# EAGLE design 09_JMP (EAGLE 7.5.0)
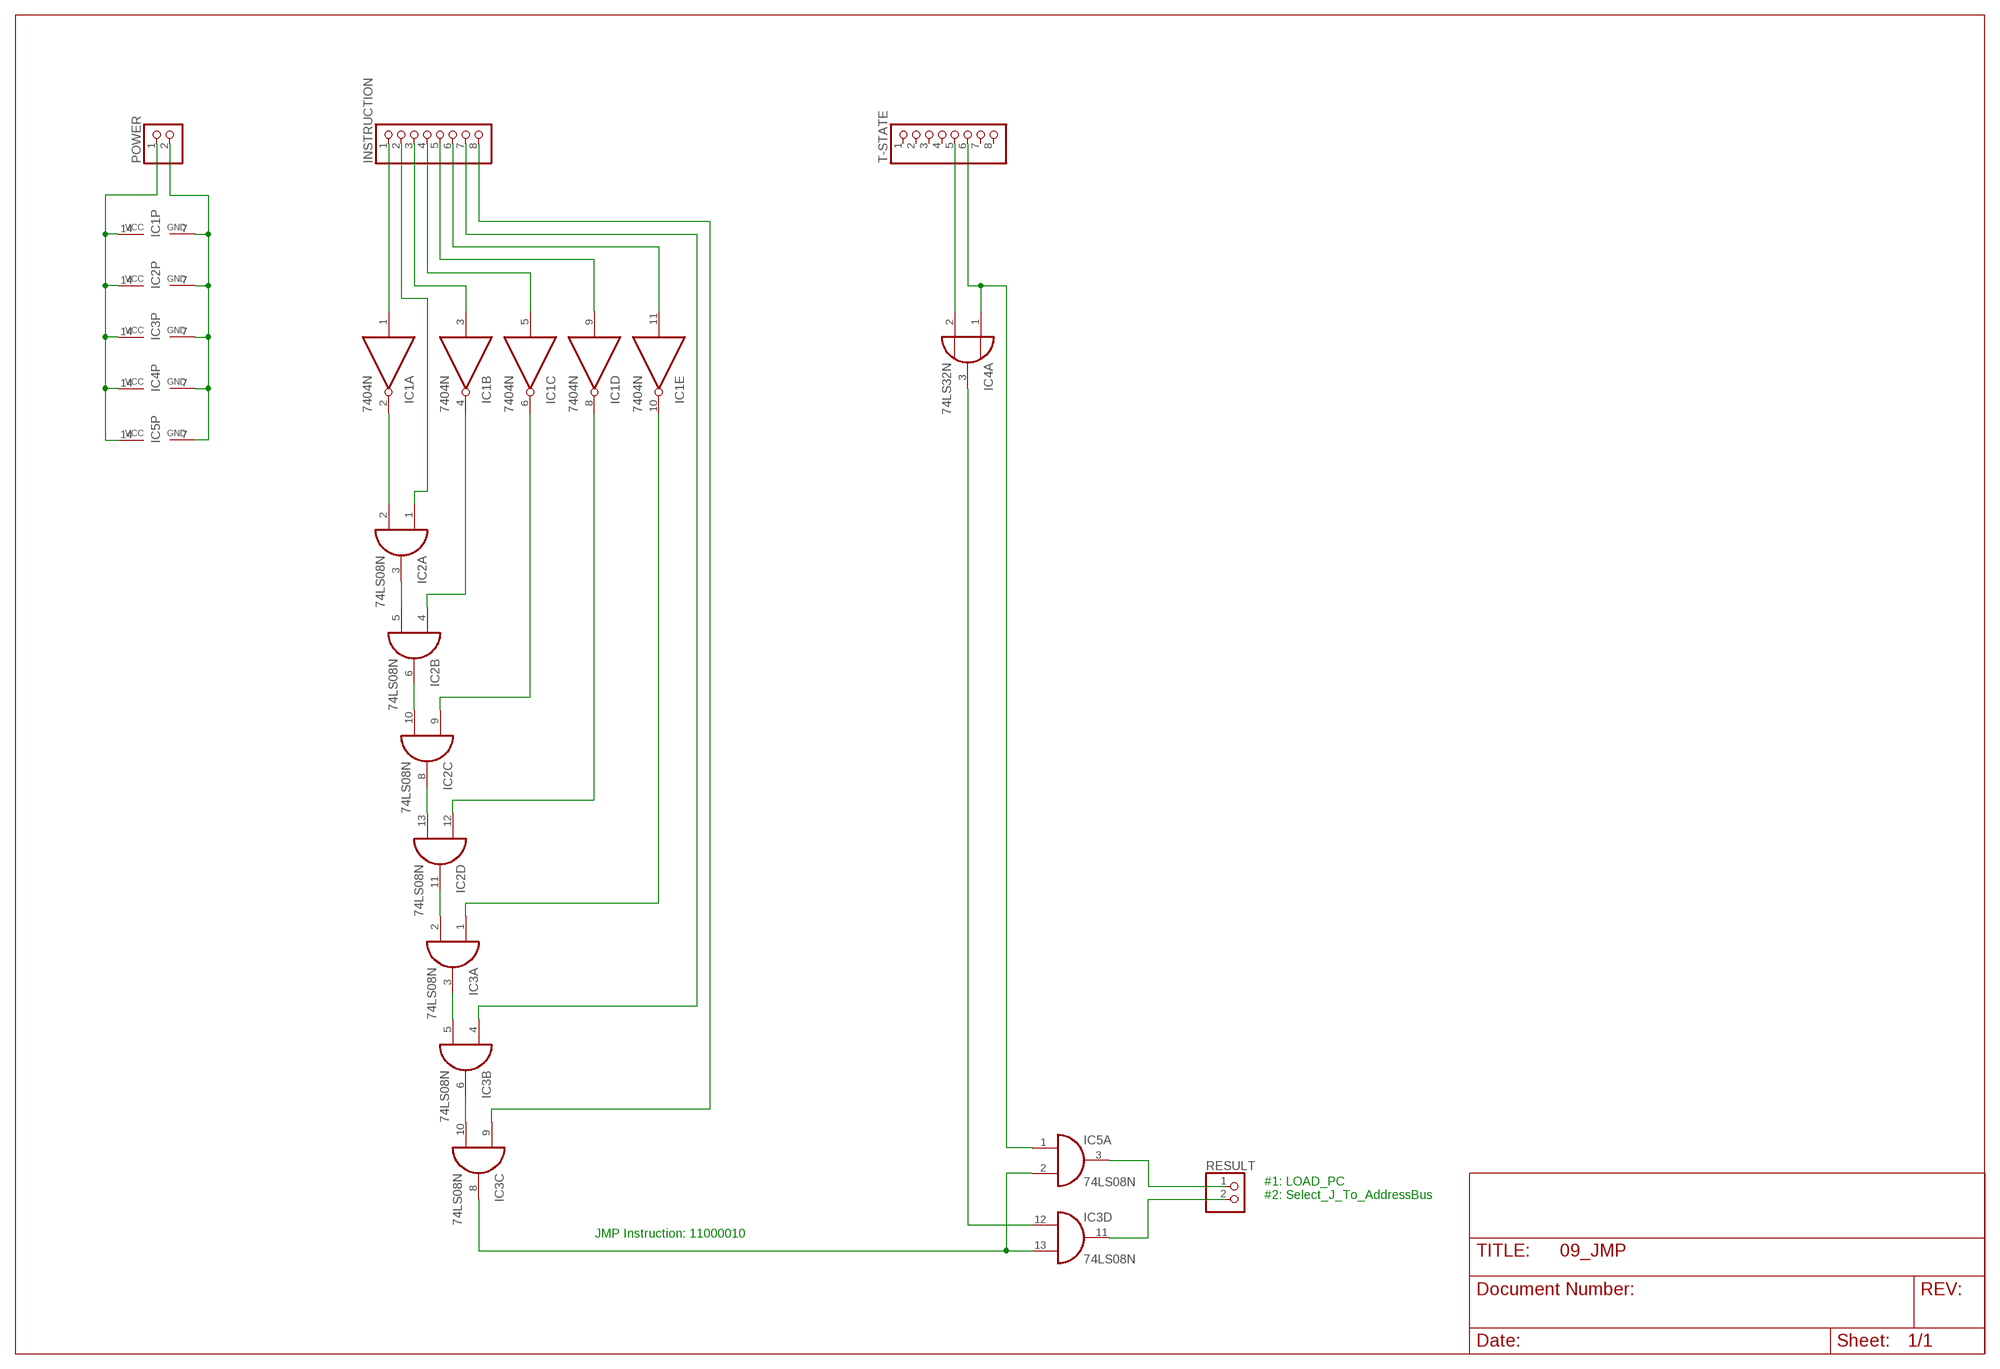
[diagram p0: schematic, sheet 1]

## Parts
IC1  7404N  [DIL14]
IC2  74LS08N  [DIL14]
IC3  74LS08N  [DIL14]
IC4  74LS32N  [DIL14]
IC5  74LS08N  [DIL14]
INSTRUCTION  PINHD-1X8  [1X08]
POWER  PINHD-1X2  [1X02]
RESULT  PINHD-1X2  [1X02]
T-STATE  PINHD-1X8  [1X08]

## Nets
GND: IC1.7(P:GND) IC2.7(P:GND) IC3.7(P:GND) IC4.7(P:GND) IC5.7(P:GND) POWER.2
N$1: IC1.1(A:I) INSTRUCTION.1
N$2: IC2.1(A:I0) INSTRUCTION.2
N$3: IC1.3(B:I) INSTRUCTION.3
N$4: IC1.5(C:I) INSTRUCTION.4
N$5: IC1.9(D:I) INSTRUCTION.5
N$6: IC1.11(E:I) INSTRUCTION.6
N$7: IC3.4(B:I0) INSTRUCTION.7
N$8: IC3.9(C:I0) INSTRUCTION.8
N$9: IC1.4(B:O) IC2.4(B:I0)
N$10: IC1.2(A:O) IC2.2(A:I1)
N$11: IC1.6(C:O) IC2.9(C:I0)
N$12: IC1.8(D:O) IC2.12(D:I0)
N$13: IC1.10(E:O) IC3.1(A:I0)
N$14: IC2.3(A:O) IC2.5(B:I1)
N$15: IC4.2(A:I1) T-STATE.5
N$16: IC2.6(B:O) IC2.10(C:I1)
N$17: IC4.1(A:I0) IC5.1(A:I0) T-STATE.6
N$18: IC2.8(C:O) IC2.13(D:I1)
N$19: IC3.12(D:I0) IC4.3(A:O)
N$20: IC2.11(D:O) IC3.2(A:I1)
N$21: IC3.3(A:O) IC3.5(B:I1)
N$22: IC3.6(B:O) IC3.10(C:I1)
N$24: IC5.3(A:O) RESULT.1
N$25: IC3.11(D:O) RESULT.2
N$26: IC3.8(C:O) IC3.13(D:I1) IC5.2(A:I1)
VCC: IC1.14(P:VCC) IC2.14(P:VCC) IC3.14(P:VCC) IC4.14(P:VCC) IC5.14(P:VCC) POWER.1
Unconnected: IC1.12(F:O) IC1.13(F:I) IC4.4(B:I0) IC4.5(B:I1) IC4.6(B:O) IC4.8(C:O) IC4.9(C:I0) IC4.10(C:I1) IC4.11(D:O) IC4.12(D:I0) IC4.13(D:I1) IC5.4(B:I0) IC5.5(B:I1) IC5.6(B:O) IC5.8(C:O) IC5.9(C:I0) IC5.10(C:I1) IC5.11(D:O) IC5.12(D:I0) IC5.13(D:I1) T-STATE.1 T-STATE.2 T-STATE.3 T-STATE.4 T-STATE.7 T-STATE.8

## Notes on the sheet
- #1: LOAD_PC
  #2: Select_J_To_AddressBus
- JMP Instruction: 11000010

## Library data of the parts
IC1 = 74xx-eu:74*04: Hex INVERTER
IC2 IC3 IC5 = 74xx-eu:74*08: Quad 2-input AND gate
IC4 = 74xx-eu:74*32: Quad 2-input OR gate
INSTRUCTION T-STATE = pinhead:PINHD-1X8: PIN HEADER
POWER RESULT = pinhead:PINHD-1X2: PIN HEADER

## Board
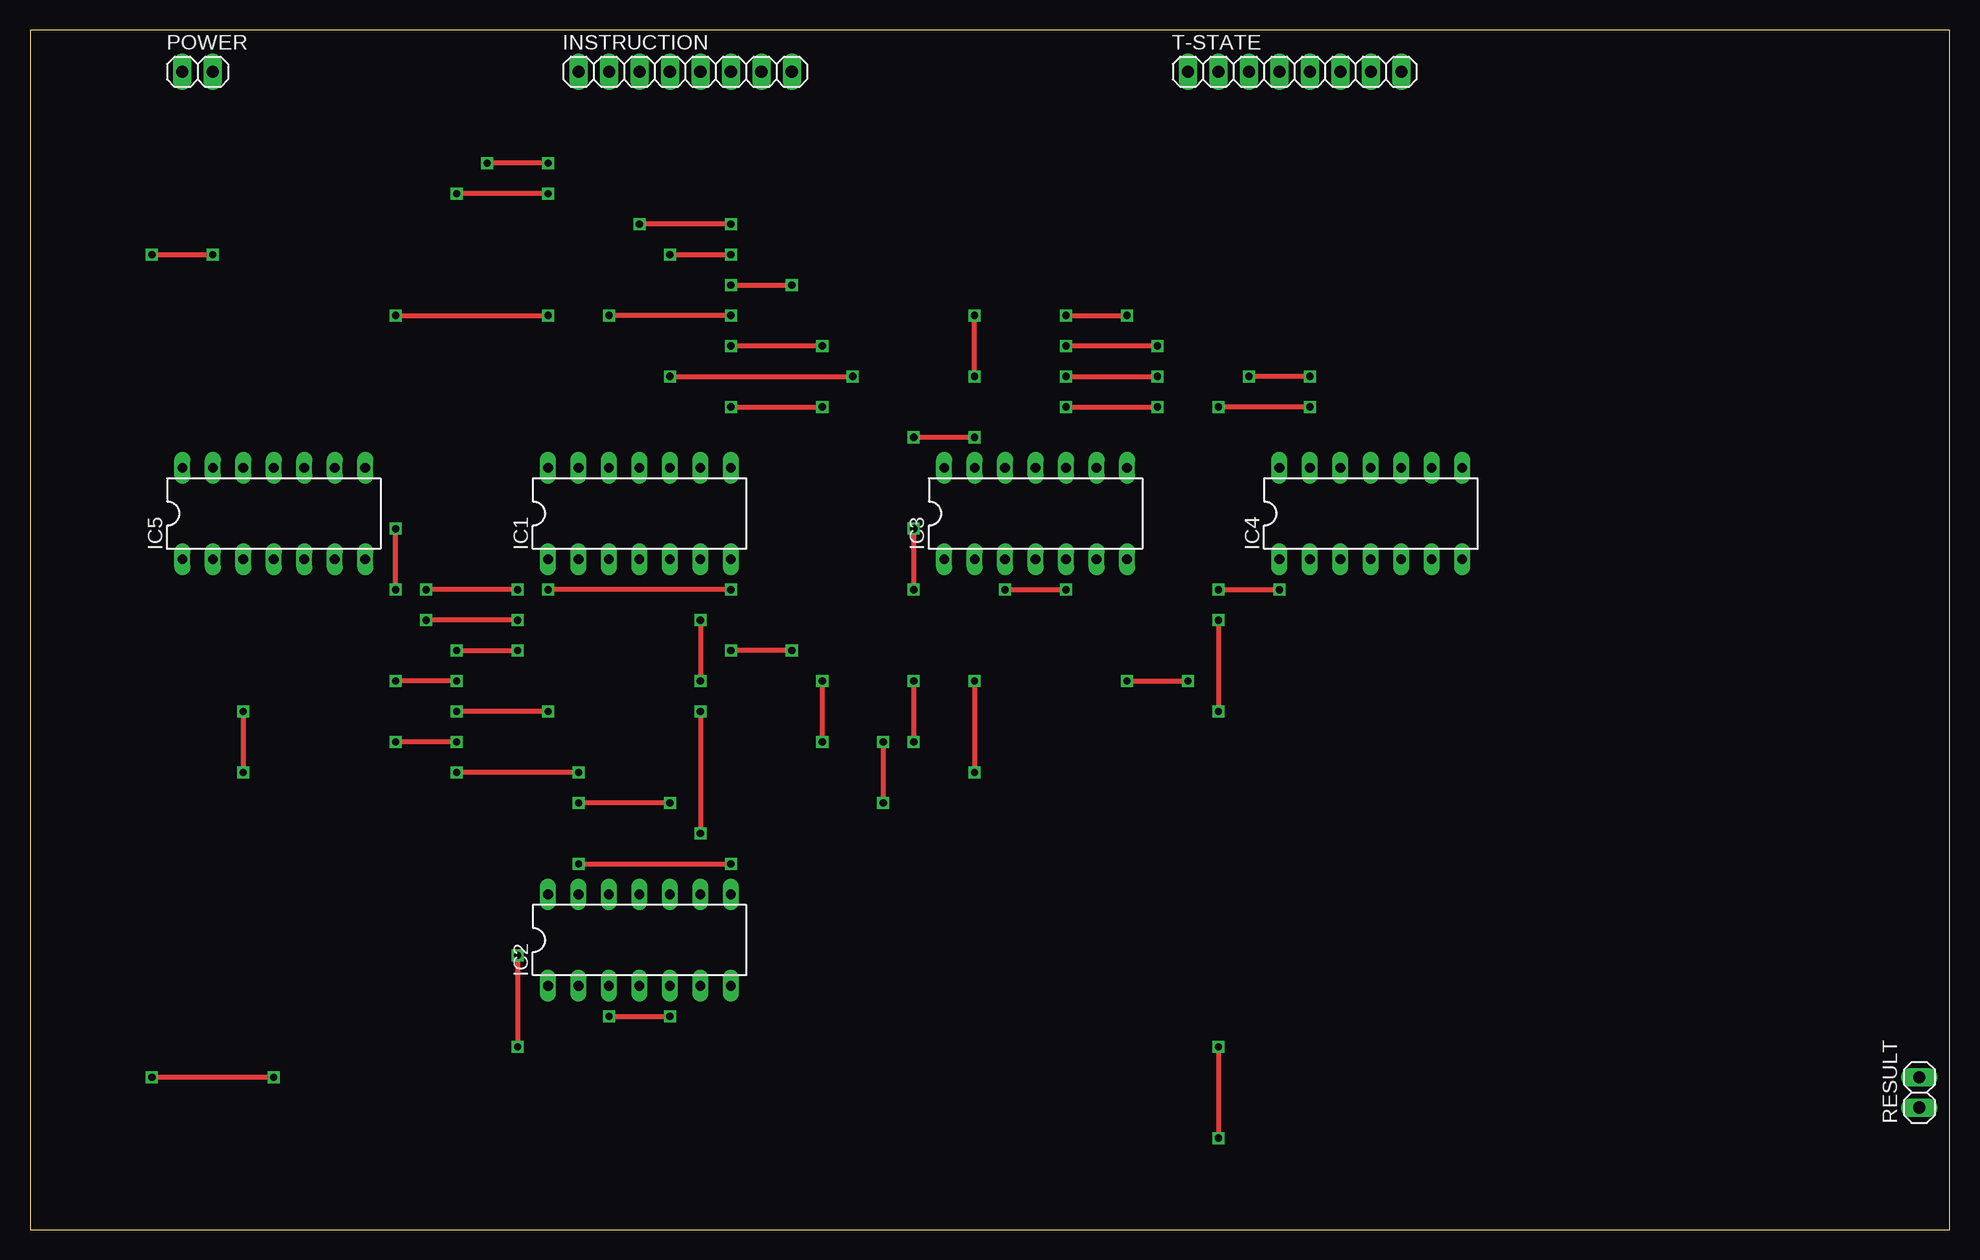
[diagram p1: board, top side]
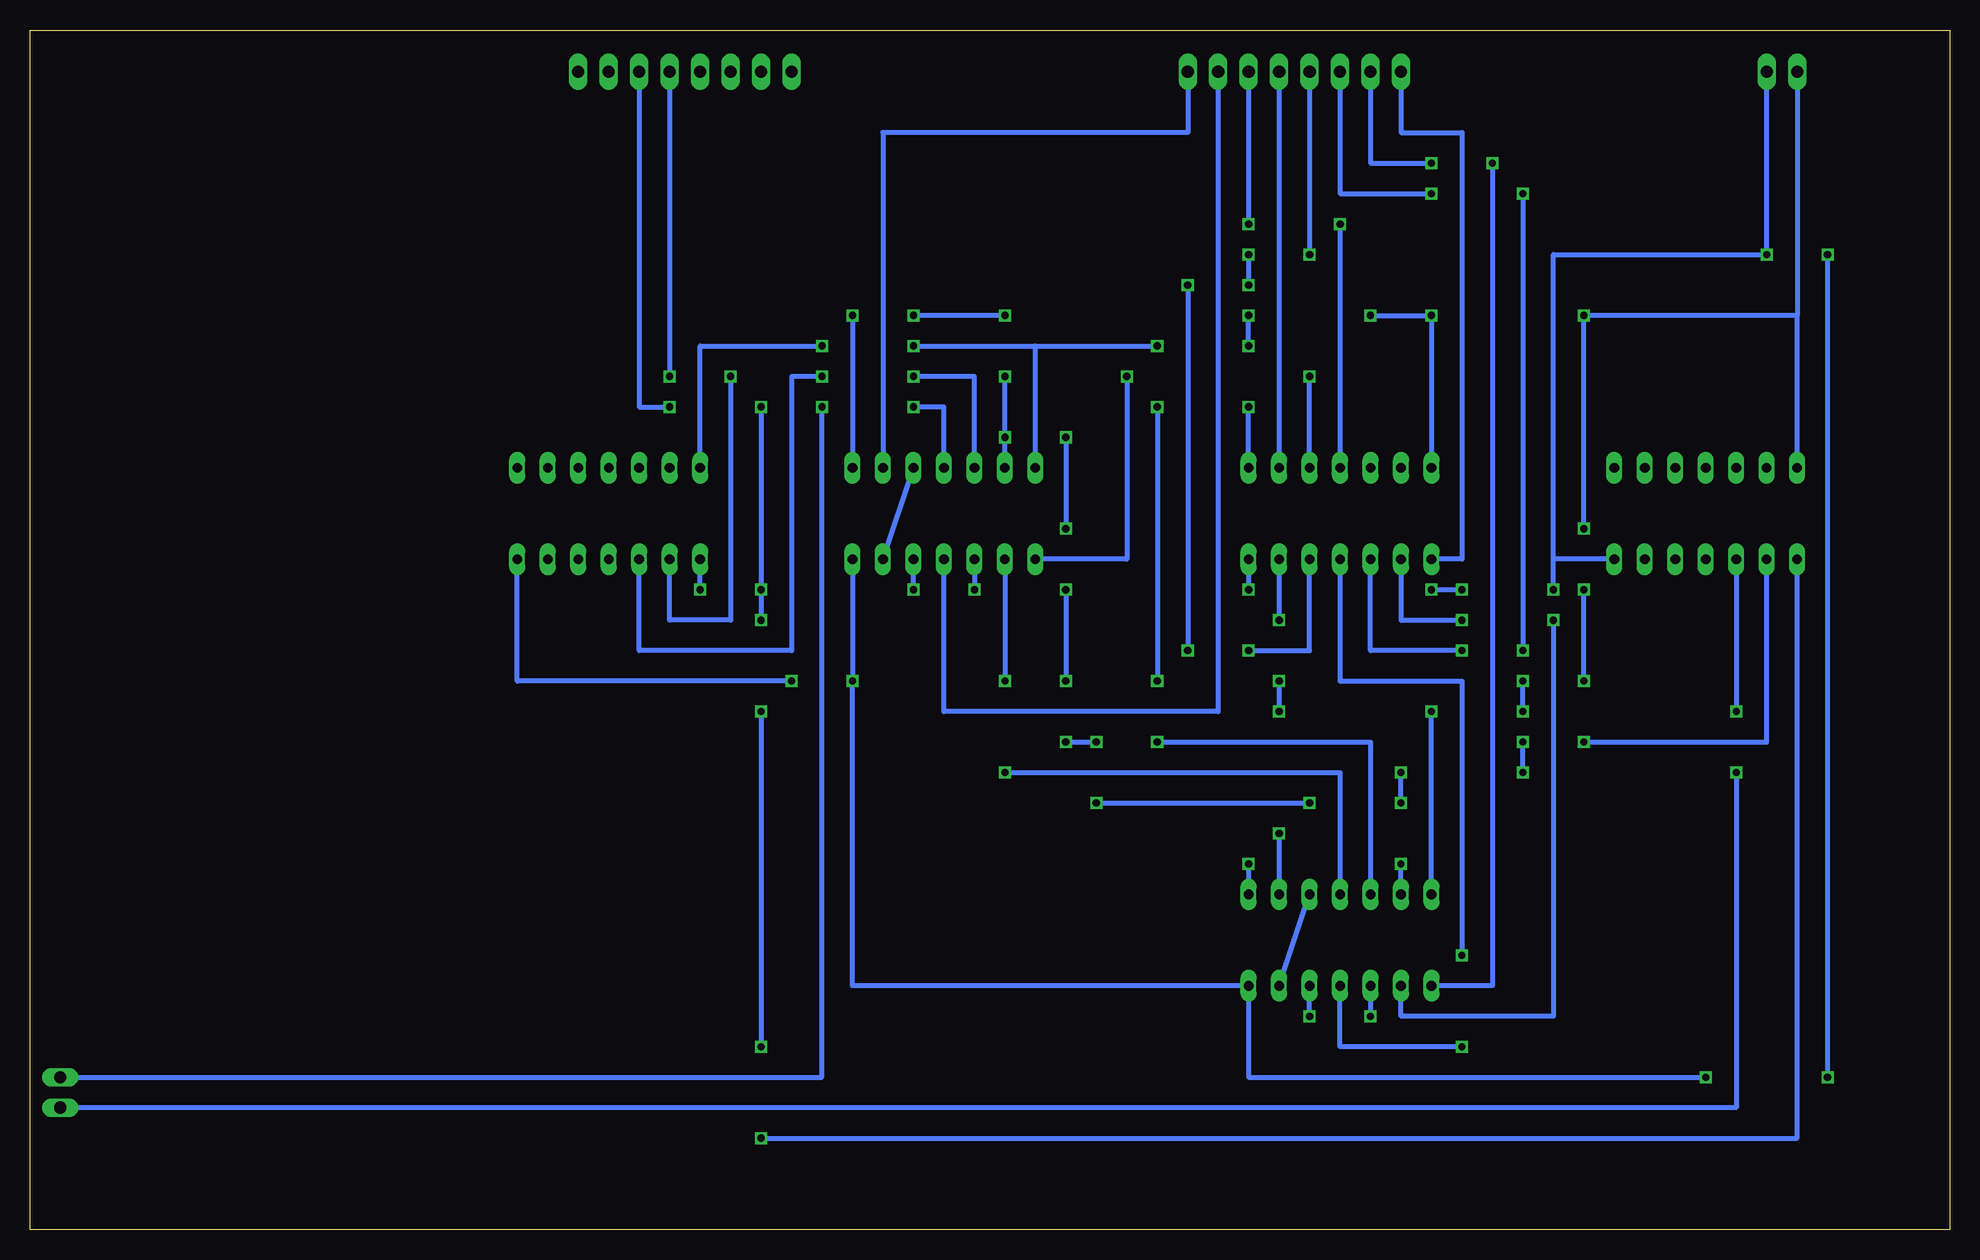
[diagram p2: board, bottom side, seen from below]

Size 160 x 100 mm. Coordinates in mm from the lower left corner, seen from the top.
Outline: 0,0 160,0 160,100 0,100 0,0
Copper layers (1*16): Top 0.035mm / dielectric 1.5mm / Bottom 0.035mm
Design rules "default": minimum track width 10mil, minimum drill 24mil, track to track 8mil, track to pad 8mil, pad to pad 8mil, via to via 8mil, smd to smd 8mil, copper to edge 40mil, drill to drill 8mil, minimum pad ring 10mil, minimum via ring 8mil, stop-mask expansion 4mil, vias tented up to drill 0mil, thermal gap 10mil

### Footprints (pad centres in the part's own frame; a part is rotated, then mirrored left to right if it is on the bottom)
DIL14 = drill 0.813 long: 1 -7.62,-3.81; 2 -5.08,-3.81; 3 -2.54,-3.81; 4 0,-3.81; 5 2.54,-3.81; 6 5.08,-3.81; 7 7.62,-3.81; 8 7.62,3.81; 9 5.08,3.81; 10 2.54,3.81; 11 0,3.81; 12 -2.54,3.81; 13 -5.08,3.81; 14 -7.62,3.81
1X08 = drill 1.016 long: 1 -8.89,0; 2 -6.35,0; 3 -3.81,0; 4 -1.27,0; 5 1.27,0; 6 3.81,0; 7 6.35,0; 8 8.89,0
1X02 = drill 1.016 long: 1 -1.27,0; 2 1.27,0

### Placement (x,y rotation side)
IC1  50.8,59.69 0 top
IC2  50.8,24.13 0 top
IC3  83.82,59.69 0 top
IC4  111.76,59.69 0 top
IC5  20.32,59.69 0 top
INSTRUCTION  54.61,96.52 0 top
POWER  13.97,96.52 0 top
RESULT  157.48,11.43 90 top
T-STATE  105.41,96.52 0 top

### Tracks (layer width: path | path; a pad name or v marks a point on that pad's centre or on a via)
GND  (via drill 0.6)
  Top 0.406: v58.42,53.34 v43.18,53.34 | v40.64,53.34 v33.02,53.34 | v91.44,45.72 v96.52,45.72 | v20.32,12.7 v10.16,12.7 | v10.16,81.28 v15.24,81.28
  Bottom 0.406: IC1.7 v58.42,53.34 | v43.18,53.34 v40.64,53.34 | v33.02,53.34 33.02,55.88 | 33.02,55.88 33.02,81.28 v15.24,81.28 POWER.2 | IC5.7 33.02,55.88 | IC3.7 v91.44,45.72 91.44,20.32 IC2.7 58.42,12.7 v20.32,12.7 | v96.52,45.72 119.38,45.72 IC4.7 | v10.16,12.7 v10.16,81.28
N$1
  Bottom 0.406: INSTRUCTION.1 45.72,91.44 40.64,91.44 40.64,55.88 IC1.1
N$2  (via drill 0.6)
  Top 0.406: v43.18,88.9 v38.1,88.9
  Bottom 0.406: INSTRUCTION.2 48.26,88.9 v43.18,88.9 | v38.1,88.9 38.1,20.32 IC2.1
N$3  (via drill 0.6)
  Top 0.406: v43.18,86.36 v35.56,86.36 | v35.56,48.26 v40.64,48.26
  Bottom 0.406: INSTRUCTION.3 50.8,86.36 v43.18,86.36 | v35.56,86.36 v35.56,48.26 | v40.64,48.26 48.26,48.26 IC1.3
N$4  (via drill 0.6)
  Top 0.406: v53.34,81.28 v58.42,81.28 | v58.42,78.74 v63.5,78.74 | v63.5,48.26 v58.42,48.26
  Bottom 0.406: INSTRUCTION.4 v53.34,81.28 | v58.42,81.28 v58.42,78.74 | v63.5,78.74 v63.5,48.26 | v58.42,48.26 53.34,48.26 IC1.5
N$5
  Bottom 0.406: INSTRUCTION.5 IC1.9
N$6  (via drill 0.6)
  Top 0.406: v58.42,83.82 v50.8,83.82
  Bottom 0.406: INSTRUCTION.6 v58.42,83.82 | v50.8,83.82 IC1.11
N$7
  Bottom 0.406: INSTRUCTION.7 60.96,43.18 83.82,43.18 IC3.4
N$8
  Bottom 0.406: INSTRUCTION.8 63.5,91.44 88.9,91.44 IC3.9
N$9  (via drill 0.6)
  Top 0.406: v40.64,22.86 v40.64,15.24
  Bottom 0.406: IC1.4 50.8,45.72 40.64,45.72 v40.64,22.86 | v40.64,15.24 50.8,15.24 IC2.4
N$10  (via drill 0.6)
  Top 0.406: v40.64,50.8 v33.02,50.8
  Bottom 0.406: IC1.2 45.72,50.8 v40.64,50.8 | v33.02,50.8 33.02,17.78 45.72,17.78 IC2.2
N$11  (via drill 0.6)
  Top 0.406: v55.88,50.8 v55.88,45.72 | v55.88,43.18 v55.88,33.02
  Bottom 0.406: IC1.6 v55.88,50.8 | v55.88,45.72 v55.88,43.18 | v55.88,33.02 IC2.9
N$12  (via drill 0.6)
  Top 0.406: v58.42,68.58 v66.04,68.58 | v66.04,45.72 v66.04,40.64
  Bottom 0.406: IC1.8 v58.42,68.58 | v66.04,68.58 v66.04,45.72 | v66.04,40.64 48.26,40.64 IC2.12
N$13  (via drill 0.6)
  Top 0.406: v53.34,71.12 v68.58,71.12
  Bottom 0.406: IC1.10 v53.34,71.12 | v68.58,71.12 68.58,55.88 IC3.1
N$14  (via drill 0.6)
  Top 0.406: v48.26,17.78 v53.34,17.78
  Bottom 0.406: IC2.3 v48.26,17.78 | v53.34,17.78 IC2.5
N$15  (via drill 0.6)
  Top 0.406: v106.68,71.12 v101.6,71.12
  Bottom 0.406: T-STATE.5 v106.68,71.12 | v101.6,71.12 101.6,50.8 106.68,50.8 IC4.2
N$16
  Bottom 0.406: IC2.6 IC2.10
N$17  (via drill 0.6)
  Top 0.406: v106.68,68.58 v99.06,68.58 | v99.06,53.34 v104.14,53.34 | v99.06,50.8 v99.06,43.18 | v99.06,15.24 v99.06,7.62
  Bottom 0.406: T-STATE.6 109.22,68.58 v106.68,68.58 | v99.06,68.58 v99.06,53.34 v99.06,50.8 | v104.14,53.34 IC4.1 | v99.06,43.18 v99.06,15.24 | v99.06,7.62 12.7,7.62 IC5.1
N$18  (via drill 0.6)
  Top 0.406: v45.72,30.48 v58.42,30.48
  Bottom 0.406: IC2.13 v45.72,30.48 | v58.42,30.48 IC2.8
N$19  (via drill 0.6)
  Top 0.406: v86.36,71.12 v93.98,71.12
  Bottom 0.406: IC3.12 81.28,71.12 v86.36,71.12 | v93.98,71.12 96.52,71.12 96.52,48.26 109.22,48.26 IC4.3
N$20  (via drill 0.6)
  Top 0.406: v78.74,45.72 v78.74,38.1
  Bottom 0.406: IC3.2 v78.74,45.72 | v78.74,38.1 50.8,38.1 IC2.11
N$21  (via drill 0.6)
  Top 0.406: v81.28,53.34 v86.36,53.34
  Bottom 0.406: IC3.3 v81.28,53.34 | v86.36,53.34 IC3.5
N$22
  Bottom 0.406: IC3.6 IC3.10
N$24  (via drill 0.6)
  Top 0.406: v17.78,43.18 v17.78,38.1
  Bottom 0.406: IC5.3 v17.78,43.18 | v17.78,38.1 17.78,10.16 RESULT.1
N$25  (via drill 0.6)
  Top 0.406: v86.36,68.58 v93.98,68.58
  Bottom 0.406: IC3.11 83.82,68.58 v86.36,68.58 | RESULT.2 93.98,12.7 v93.98,68.58
N$26  (via drill 0.6)
  Top 0.406: v78.74,71.12 v78.74,76.2 | v86.36,76.2 v91.44,76.2 | v78.74,66.04 v73.66,66.04 | v73.66,58.42 v73.66,53.34 | v73.66,45.72 v73.66,40.64 | v71.12,40.64 v71.12,35.56 | v53.34,35.56 v45.72,35.56 | v45.72,38.1 v35.56,38.1 | v35.56,40.64 v30.48,40.64
  Bottom 0.406: v78.74,71.12 v78.74,66.04 IC3.13 | v78.74,76.2 v86.36,76.2 | v91.44,76.2 IC3.8 | v73.66,66.04 v73.66,58.42 | v73.66,53.34 v73.66,45.72 | v73.66,40.64 v71.12,40.64 | v71.12,35.56 v53.34,35.56 | v45.72,35.56 v45.72,38.1 | v35.56,38.1 v35.56,40.64 | v30.48,40.64 15.24,40.64 IC5.2
VCC  (via drill 0.6)
  Top 0.406: v30.48,76.2 v43.18,76.2 | v93.98,73.66 v86.36,73.66 | v66.04,73.66 v58.42,73.66 | v58.42,76.2 v48.26,76.2 | v43.18,43.18 v35.56,43.18 | v35.56,45.72 v30.48,45.72 | v30.48,53.34 v30.48,58.42
  Bottom 0.406: POWER.1 12.7,76.2 | IC5.14 12.7,76.2 | 12.7,76.2 v30.48,76.2 v30.48,58.42 | IC1.14 v43.18,76.2 v48.26,76.2 | IC4.14 104.14,73.66 v93.98,73.66 | v86.36,73.66 76.2,73.66 | 76.2,73.66 v66.04,73.66 | v58.42,73.66 v58.42,76.2 | IC3.14 76.2,73.66 | IC2.14 v43.18,43.18 | v35.56,43.18 v35.56,45.72 | v30.48,45.72 v30.48,53.34